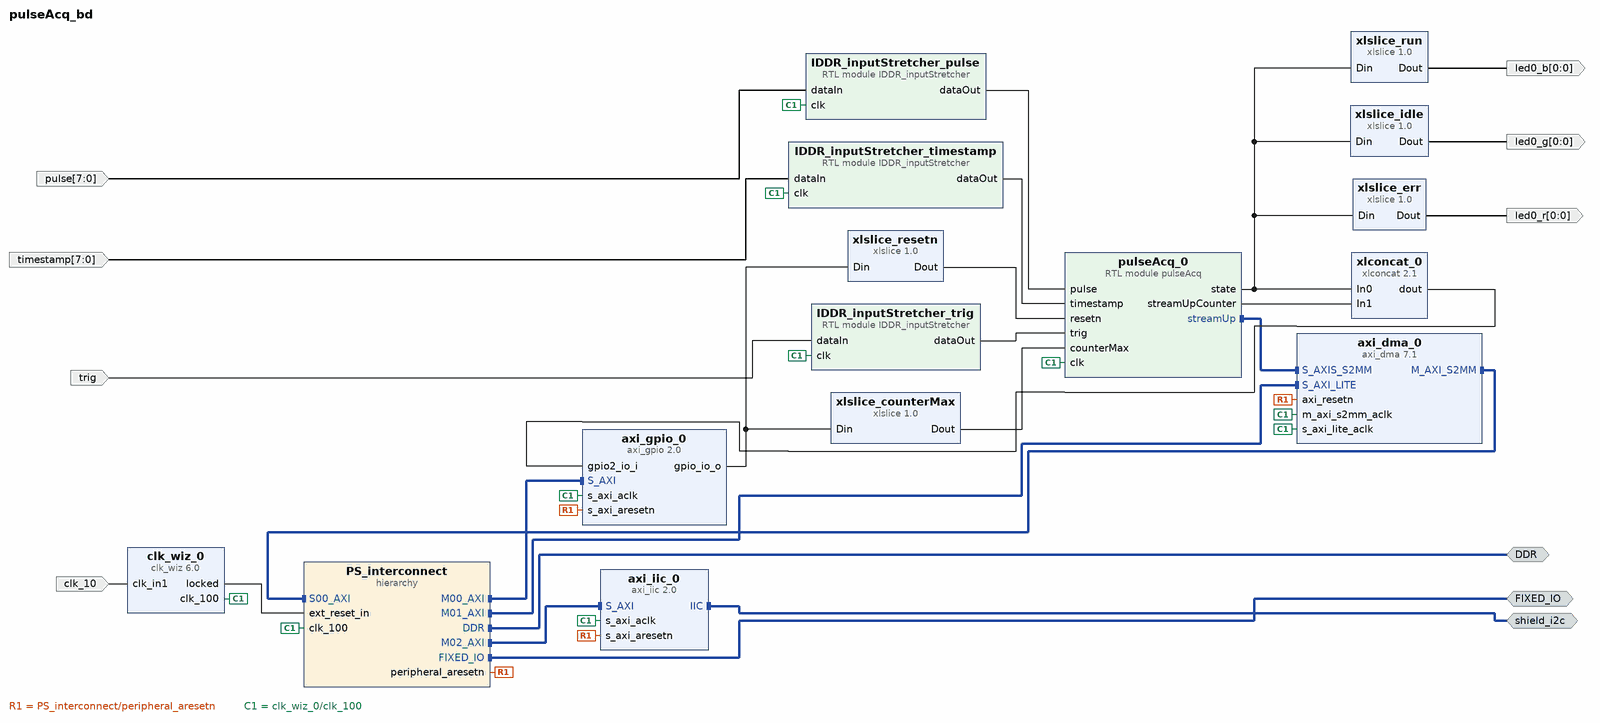
[diagram p0: block diagram of the top level]
# Vivado block design pulseAcq_bd, xc7z010clg400-1, Vivado 2018.3
create_bd_design pulseAcq_bd

create_bd_intf_port -mode Master -vlnv xilinx.com:interface:ddrx_rtl:1.0 DDR
create_bd_intf_port -mode Master -vlnv xilinx.com:display_processing_system7:fixedio_rtl:1.0 FIXED_IO
create_bd_intf_port -mode Master -vlnv xilinx.com:interface:iic_rtl:1.0 shield_i2c
create_bd_port -dir O -from 0 -to 0 led0_b
create_bd_port -dir O -from 0 -to 0 led0_g
create_bd_port -dir O -from 0 -to 0 led0_r
create_bd_port -dir I trig
create_bd_port -dir I -from 7 -to 0 pulse
create_bd_port -dir I -from 7 -to 0 timestamp
create_bd_port -dir I -type clk clk_10
set_property -dict {CONFIG.FREQ_HZ 10000000} [get_bd_ports clk_10]

create_bd_cell -type hier PS_interconnect
create_bd_cell -type ip -vlnv xilinx.com:ip:axi_dma:7.1 axi_dma_0
set_property -dict [list \
  CONFIG.c_include_mm2s 0 \
  CONFIG.c_include_s2mm 1 \
  CONFIG.c_include_sg 0 \
  CONFIG.c_m_axi_s2mm_data_width 64 \
  CONFIG.c_s2mm_burst_size 16 \
  CONFIG.c_sg_length_width 24 \
] [get_bd_cells axi_dma_0]
create_bd_cell -type ip -vlnv xilinx.com:ip:axi_gpio:2.0 axi_gpio_0
set_property -dict [list \
  CONFIG.C_ALL_INPUTS 0 \
  CONFIG.C_ALL_INPUTS_2 1 \
  CONFIG.C_ALL_OUTPUTS 1 \
  CONFIG.C_GPIO2_WIDTH 27 \
  CONFIG.C_GPIO_WIDTH 25 \
  CONFIG.C_IS_DUAL 1 \
] [get_bd_cells axi_gpio_0]
create_bd_cell -type ip -vlnv xilinx.com:ip:xlslice:1.0 xlslice_err
set_property -dict {CONFIG.DIN_FROM 2 CONFIG.DIN_TO 2 CONFIG.DIN_WIDTH 3 CONFIG.DOUT_WIDTH 1} [get_bd_cells xlslice_err]
create_bd_cell -type ip -vlnv xilinx.com:ip:xlslice:1.0 xlslice_idle
set_property -dict {CONFIG.DIN_FROM 0 CONFIG.DIN_TO 0 CONFIG.DIN_WIDTH 3} [get_bd_cells xlslice_idle]
create_bd_cell -type ip -vlnv xilinx.com:ip:xlslice:1.0 xlslice_counterMax
set_property -dict {CONFIG.DIN_FROM 24 CONFIG.DIN_TO 1 CONFIG.DIN_WIDTH 25 CONFIG.DOUT_WIDTH 24} [get_bd_cells xlslice_counterMax]
create_bd_cell -type ip -vlnv xilinx.com:ip:xlslice:1.0 xlslice_resetn
set_property -dict {CONFIG.DIN_FROM 0 CONFIG.DIN_TO 0 CONFIG.DIN_WIDTH 25 CONFIG.DOUT_WIDTH 1} [get_bd_cells xlslice_resetn]
create_bd_cell -type ip -vlnv xilinx.com:ip:xlslice:1.0 xlslice_run
set_property -dict {CONFIG.DIN_FROM 1 CONFIG.DIN_TO 1 CONFIG.DIN_WIDTH 3 CONFIG.DOUT_WIDTH 1} [get_bd_cells xlslice_run]
create_bd_cell -type ip -vlnv xilinx.com:ip:xlconcat:2.1 xlconcat_0
set_property -dict {CONFIG.IN0_WIDTH 3 CONFIG.IN1_WIDTH 24} [get_bd_cells xlconcat_0]
create_bd_cell -type ip -vlnv xilinx.com:ip:clk_wiz:6.0 clk_wiz_0
set_property -dict [list \
  CONFIG.CLKIN1_JITTER_PS 990.0000000000001 \
  CONFIG.CLKIN1_UI_JITTER 0.0099 \
  CONFIG.CLKOUT1_JITTER 636.441 \
  CONFIG.CLKOUT1_PHASE_ERROR 892.144 \
  CONFIG.CLKOUT1_REQUESTED_OUT_FREQ 100 \
  CONFIG.CLK_OUT1_PORT clk_100 \
  CONFIG.MMCM_CLKFBOUT_MULT_F 63.750 \
  CONFIG.MMCM_CLKIN1_PERIOD 100.000 \
  CONFIG.MMCM_CLKIN2_PERIOD 10.0 \
  CONFIG.MMCM_CLKOUT0_DIVIDE_F 6.375 \
  CONFIG.MMCM_DIVCLK_DIVIDE 1 \
  CONFIG.MMCM_REF_JITTER1 0.010 \
  CONFIG.PRIM_IN_FREQ 10 \
  CONFIG.USE_RESET false \
] [get_bd_cells clk_wiz_0]
create_bd_cell -type module -reference pulseAcq pulseAcq_0
set_property -dict {CONFIG.CHANNELS 8} [get_bd_cells pulseAcq_0]
create_bd_cell -type module -reference IDDR_inputStretcher IDDR_inputStretcher_trig
create_bd_cell -type module -reference IDDR_inputStretcher IDDR_inputStretcher_pulse
set_property -dict {CONFIG.PORT_WIDTH 8} [get_bd_cells IDDR_inputStretcher_pulse]
create_bd_cell -type module -reference IDDR_inputStretcher IDDR_inputStretcher_timestamp
set_property -dict {CONFIG.PORT_WIDTH 8} [get_bd_cells IDDR_inputStretcher_timestamp]
create_bd_cell -type ip -vlnv xilinx.com:ip:axi_iic:2.0 axi_iic_0
set_property -dict {CONFIG.IIC_BOARD_INTERFACE shield_i2c CONFIG.USE_BOARD_FLOW true} [get_bd_cells axi_iic_0]

# ---- hierarchy /PS_interconnect ----
current_bd_instance /PS_interconnect
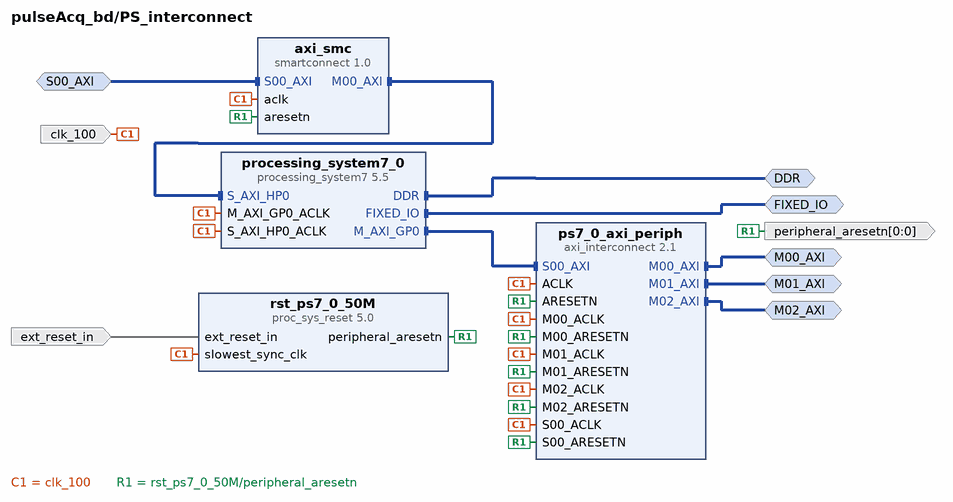
[diagram p1: block diagram inside /PS_interconnect]
create_bd_intf_pin -mode Master -vlnv xilinx.com:interface:ddrx_rtl:1.0 DDR
create_bd_intf_pin -mode Master -vlnv xilinx.com:display_processing_system7:fixedio_rtl:1.0 FIXED_IO
create_bd_intf_pin -mode Master -vlnv xilinx.com:interface:aximm_rtl:1.0 M00_AXI
create_bd_intf_pin -mode Master -vlnv xilinx.com:interface:aximm_rtl:1.0 M01_AXI
create_bd_intf_pin -mode Slave -vlnv xilinx.com:interface:aximm_rtl:1.0 S00_AXI
create_bd_intf_pin -mode Master -vlnv xilinx.com:interface:aximm_rtl:1.0 M02_AXI
create_bd_pin -dir O -from 0 -to 0 -type rst peripheral_aresetn
create_bd_pin -dir I clk_100
create_bd_pin -dir I -type rst ext_reset_in

create_bd_cell -type ip -vlnv xilinx.com:ip:smartconnect:1.0 axi_smc
set_property -dict {CONFIG.NUM_SI 1} [get_bd_cells axi_smc]
create_bd_cell -type ip -vlnv xilinx.com:ip:processing_system7:5.5 processing_system7_0
set_property -dict [list \
  CONFIG.PCW_APU_PERIPHERAL_FREQMHZ 650 \
  CONFIG.PCW_CRYSTAL_PERIPHERAL_FREQMHZ 50 \
  CONFIG.PCW_ENET0_ENET0_IO {MIO 16 .. 27} \
  CONFIG.PCW_ENET0_GRP_MDIO_ENABLE 1 \
  CONFIG.PCW_ENET0_GRP_MDIO_IO {MIO 52 .. 53} \
  CONFIG.PCW_ENET0_PERIPHERAL_ENABLE 1 \
  CONFIG.PCW_ENET0_RESET_ENABLE 1 \
  CONFIG.PCW_ENET0_RESET_IO {MIO 9} \
  CONFIG.PCW_ENET_RESET_ENABLE 1 \
  CONFIG.PCW_ENET_RESET_SELECT {Share reset pin} \
  CONFIG.PCW_FPGA0_PERIPHERAL_FREQMHZ 100 \
  CONFIG.PCW_FPGA1_PERIPHERAL_FREQMHZ 50 \
  CONFIG.PCW_GPIO_MIO_GPIO_ENABLE 1 \
  CONFIG.PCW_GPIO_MIO_GPIO_IO MIO \
  CONFIG.PCW_I2C_RESET_ENABLE 0 \
  CONFIG.PCW_PERIPHERAL_BOARD_PRESET part0 \
  CONFIG.PCW_PRESET_BANK1_VOLTAGE {LVCMOS 1.8V} \
  CONFIG.PCW_QSPI_PERIPHERAL_ENABLE 0 \
  CONFIG.PCW_SD0_GRP_CD_ENABLE 1 \
  CONFIG.PCW_SD0_GRP_CD_IO {MIO 47} \
  CONFIG.PCW_SD0_GRP_WP_ENABLE 0 \
  CONFIG.PCW_SD0_PERIPHERAL_ENABLE 1 \
  CONFIG.PCW_SD0_SD0_IO {MIO 40 .. 45} \
  CONFIG.PCW_SDIO_PERIPHERAL_FREQMHZ 100 \
  CONFIG.PCW_UART0_PERIPHERAL_ENABLE 1 \
  CONFIG.PCW_UART0_UART0_IO {MIO 14 .. 15} \
  CONFIG.PCW_UART1_PERIPHERAL_ENABLE 0 \
  CONFIG.PCW_UART_PERIPHERAL_FREQMHZ 100 \
  CONFIG.PCW_UIPARAM_DDR_BUS_WIDTH {16 Bit} \
  CONFIG.PCW_UIPARAM_DDR_FREQ_MHZ 525 \
  CONFIG.PCW_UIPARAM_DDR_PARTNO {MT41K256M16 RE-125} \
  CONFIG.PCW_USB0_PERIPHERAL_ENABLE 1 \
  CONFIG.PCW_USB0_RESET_ENABLE 1 \
  CONFIG.PCW_USB0_RESET_IO {MIO 46} \
  CONFIG.PCW_USB0_USB0_IO {MIO 28 .. 39} \
  CONFIG.PCW_USB_RESET_ENABLE 1 \
  CONFIG.PCW_USB_RESET_SELECT {Share reset pin} \
  CONFIG.PCW_USE_S_AXI_HP0 1 \
] [get_bd_cells processing_system7_0]
# 501 more settings of processing_system7_0 are not shown: defaults, MIO pin electricals, DDR timing, and values the tool derives
create_bd_cell -type ip -vlnv xilinx.com:ip:proc_sys_reset:5.0 rst_ps7_0_50M
create_bd_cell -type ip -vlnv xilinx.com:ip:axi_interconnect:2.1 ps7_0_axi_periph
set_property -dict {CONFIG.NUM_MI 3} [get_bd_cells ps7_0_axi_periph]

# ---- connections ----

current_bd_instance /PS_interconnect
connect_bd_intf_net [get_bd_intf_pins axi_smc/M00_AXI] [get_bd_intf_pins processing_system7_0/S_AXI_HP0]
connect_bd_intf_net -intf_net S01_AXI_1 [get_bd_intf_pins S00_AXI] [get_bd_intf_pins axi_smc/S00_AXI]
connect_bd_intf_net [get_bd_intf_pins processing_system7_0/M_AXI_GP0] [get_bd_intf_pins ps7_0_axi_periph/S00_AXI]
connect_bd_intf_net [get_bd_intf_pins M00_AXI] [get_bd_intf_pins ps7_0_axi_periph/M00_AXI]
connect_bd_intf_net [get_bd_intf_pins DDR] [get_bd_intf_pins processing_system7_0/DDR]
connect_bd_intf_net [get_bd_intf_pins M01_AXI] [get_bd_intf_pins ps7_0_axi_periph/M01_AXI]
connect_bd_intf_net [get_bd_intf_pins FIXED_IO] [get_bd_intf_pins processing_system7_0/FIXED_IO]
connect_bd_intf_net [get_bd_intf_pins M02_AXI] [get_bd_intf_pins ps7_0_axi_periph/M02_AXI]
connect_bd_net -net processing_system7_0_FCLK_CLK0 [get_bd_pins clk_100] \
  [get_bd_pins processing_system7_0/S_AXI_HP0_ACLK] [get_bd_pins processing_system7_0/M_AXI_GP0_ACLK] \
  [get_bd_pins ps7_0_axi_periph/S00_ACLK] [get_bd_pins rst_ps7_0_50M/slowest_sync_clk] \
  [get_bd_pins ps7_0_axi_periph/M00_ACLK] [get_bd_pins ps7_0_axi_periph/ACLK] [get_bd_pins ps7_0_axi_periph/M01_ACLK] \
  [get_bd_pins axi_smc/aclk] [get_bd_pins ps7_0_axi_periph/M02_ACLK]
connect_bd_net [get_bd_pins rst_ps7_0_50M/peripheral_aresetn] \
  [get_bd_pins peripheral_aresetn] [get_bd_pins ps7_0_axi_periph/S00_ARESETN] [get_bd_pins ps7_0_axi_periph/M00_ARESETN] \
  [get_bd_pins ps7_0_axi_periph/ARESETN] [get_bd_pins ps7_0_axi_periph/M01_ARESETN] [get_bd_pins axi_smc/aresetn] \
  [get_bd_pins ps7_0_axi_periph/M02_ARESETN]
connect_bd_net [get_bd_pins ext_reset_in] [get_bd_pins rst_ps7_0_50M/ext_reset_in]

current_bd_instance /
connect_bd_intf_net [get_bd_intf_pins axi_dma_0/S_AXIS_S2MM] [get_bd_intf_pins pulseAcq_0/streamUp]
connect_bd_intf_net [get_bd_intf_pins axi_dma_0/M_AXI_S2MM] [get_bd_intf_pins PS_interconnect/S00_AXI]
connect_bd_intf_net -intf_net processing_system7_0_DDR [get_bd_intf_ports DDR] [get_bd_intf_pins PS_interconnect/DDR]
connect_bd_intf_net -intf_net processing_system7_0_FIXED_IO [get_bd_intf_ports FIXED_IO] [get_bd_intf_pins PS_interconnect/FIXED_IO]
connect_bd_intf_net [get_bd_intf_pins axi_dma_0/S_AXI_LITE] [get_bd_intf_pins PS_interconnect/M01_AXI]
connect_bd_intf_net [get_bd_intf_pins PS_interconnect/M00_AXI] [get_bd_intf_pins axi_gpio_0/S_AXI]
connect_bd_intf_net [get_bd_intf_pins axi_iic_0/S_AXI] [get_bd_intf_pins PS_interconnect/M02_AXI]
connect_bd_intf_net [get_bd_intf_ports shield_i2c] [get_bd_intf_pins axi_iic_0/IIC]
connect_bd_net [get_bd_pins axi_gpio_0/gpio_io_o] [get_bd_pins xlslice_counterMax/Din] [get_bd_pins xlslice_resetn/Din]
connect_bd_net -net pulseGen_0_state [get_bd_pins pulseAcq_0/state] \
  [get_bd_pins xlslice_idle/Din] [get_bd_pins xlslice_run/Din] [get_bd_pins xlslice_err/Din] [get_bd_pins xlconcat_0/In0]
connect_bd_net -net rst_ps7_0_50M_peripheral_aresetn [get_bd_pins PS_interconnect/peripheral_aresetn] \
  [get_bd_pins axi_gpio_0/s_axi_aresetn] [get_bd_pins axi_dma_0/axi_resetn] [get_bd_pins axi_iic_0/s_axi_aresetn]
connect_bd_net -net xlslice_0_Dout [get_bd_pins xlslice_counterMax/Dout] [get_bd_pins pulseAcq_0/counterMax]
connect_bd_net -net xlslice_0_Dout1 [get_bd_pins xlslice_resetn/Dout] [get_bd_pins pulseAcq_0/resetn]
connect_bd_net [get_bd_pins xlslice_err/Dout] [get_bd_ports led0_r]
connect_bd_net [get_bd_pins xlslice_idle/Dout] [get_bd_ports led0_g]
connect_bd_net [get_bd_pins xlslice_run/Dout] [get_bd_ports led0_b]
connect_bd_net [get_bd_pins pulseAcq_0/streamUpCounter] [get_bd_pins xlconcat_0/In1]
connect_bd_net [get_bd_pins xlconcat_0/dout] [get_bd_pins axi_gpio_0/gpio2_io_i]
connect_bd_net -net clk_10_1 [get_bd_ports clk_10] [get_bd_pins clk_wiz_0/clk_in1]
connect_bd_net [get_bd_pins clk_wiz_0/clk_100] \
  [get_bd_pins PS_interconnect/clk_100] [get_bd_pins axi_gpio_0/s_axi_aclk] [get_bd_pins axi_dma_0/s_axi_lite_aclk] \
  [get_bd_pins axi_dma_0/m_axi_s2mm_aclk] [get_bd_pins pulseAcq_0/clk] [get_bd_pins IDDR_inputStretcher_trig/clk] \
  [get_bd_pins IDDR_inputStretcher_pulse/clk] [get_bd_pins IDDR_inputStretcher_timestamp/clk] \
  [get_bd_pins axi_iic_0/s_axi_aclk]
connect_bd_net [get_bd_pins clk_wiz_0/locked] [get_bd_pins PS_interconnect/ext_reset_in]
connect_bd_net [get_bd_ports trig] [get_bd_pins IDDR_inputStretcher_trig/dataIn]
connect_bd_net [get_bd_ports pulse] [get_bd_pins IDDR_inputStretcher_pulse/dataIn]
connect_bd_net [get_bd_ports timestamp] [get_bd_pins IDDR_inputStretcher_timestamp/dataIn]
connect_bd_net [get_bd_pins IDDR_inputStretcher_trig/dataOut] [get_bd_pins pulseAcq_0/trig]
connect_bd_net [get_bd_pins IDDR_inputStretcher_pulse/dataOut] [get_bd_pins pulseAcq_0/pulse]
connect_bd_net [get_bd_pins IDDR_inputStretcher_timestamp/dataOut] [get_bd_pins pulseAcq_0/timestamp]

# ---- address map ----
assign_bd_address -offset 0x00000000 -range 512M -target_address_space [get_bd_addr_spaces axi_dma_0/Data_S2MM] [get_bd_addr_segs PS_interconnect/processing_system7_0/S_AXI_HP0/HP0_DDR_LOWOCM]
assign_bd_address -offset 0x40400000 -range 64K -target_address_space [get_bd_addr_spaces PS_interconnect/processing_system7_0/Data] [get_bd_addr_segs axi_dma_0/S_AXI_LITE/Reg]
assign_bd_address -offset 0x41200000 -range 64K -target_address_space [get_bd_addr_spaces PS_interconnect/processing_system7_0/Data] [get_bd_addr_segs axi_gpio_0/S_AXI/Reg]
assign_bd_address -offset 0x41600000 -range 64K -target_address_space [get_bd_addr_spaces PS_interconnect/processing_system7_0/Data] [get_bd_addr_segs axi_iic_0/S_AXI/Reg]

validate_bd_design
save_bd_design
